# Altium schematic sheet CANBUS.SchDoc
size A4; SheetNumber: 4; SheetTotal: 5
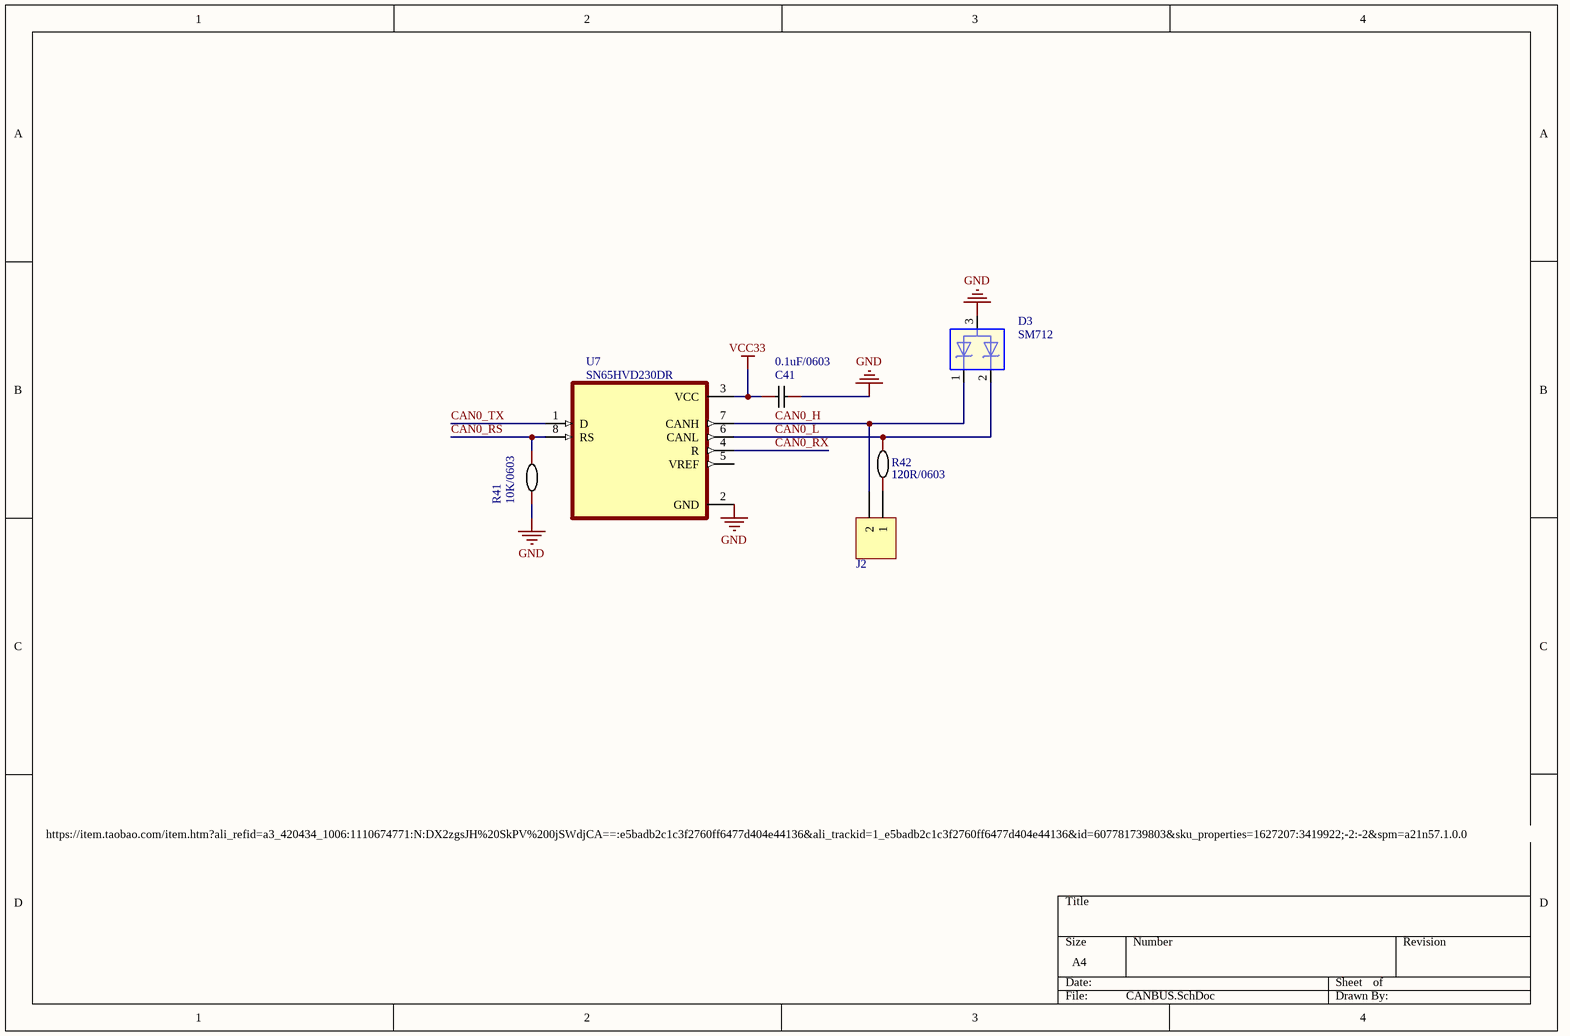
[diagram p0: CANBUS.SchDoc]

## Parts
C41  0.1uF/0603  [CAP0603]
D3  SM712  [SOT95P280X135-3N]
J2  Jumper  [HDR1X2]  (value not drawn)
R41  10K/0603  [RES0603]
R42  120R/0603  [RES0603]
U7  SN65HVD230DR  [SN65HVD230DR]

## Nets
GND: C41.1 D3.3 R41.1 U7.2(GND)
VCC33: C41.2 U7.3(VCC)
CAN0_H: D3.1 J2.2 U7.7(CANH)
CAN0_L: D3.2 R42.1 U7.6(CANL)
CAN0_RS: R41.2 U7.8(RS)
CAN0_RX: U7.4(R)
CAN0_TX: U7.1(D)
NetJ2_1: J2.1 R42.2

Not connected (* = marked no-connect by the designer): U7 5(VREF)

## Notes on the sheet
- https://item.taobao.com/item.htm?ali_refid=a3_420434_1006:1110674771:N:DX2zgsJH%20SkPV%200jSWdjCA==:e5badb2c1c3f2760ff6477d404e44136&ali_trackid=1_e5badb2c1c3f2760ff6477d404e44136&id=607781739803&sku_properties=1627207:3419922;-2:-2&spm=a21n57.1.0.0

## Library data of the parts
C41 = 100nF: Manufacturer Part: CL05B104KO5NNNC; Manufacturer: SAMSUNG; Convert to PCB: yes; Origin Footprint: C0402_NEW; Name: 100nF; Symbol: 100nF; Device: 100nF; Supplier: LCSC; Supplier Part: C1525; JLCPCB Part Class: Basic Part; Add into BOM: yes
D3 = SM05_D24: 兩路TVS二极管阵列; Part Number: 702112964; Origin: Altium; Design: 3; PCB Footprint: SOT95P280X135-3N
J2 = Header 2: Header, 2-Pin; LatestRevisionDate: 17-Jul-2002; LatestRevisionNote: Re-released for DXP Platform.; Publisher: Altium Limited
R41 = 10K: Manufacturer: UniOhm; Manufacturer Part: 0402WGF1002TCE; Convert to PCB: yes; Origin Footprint: R0402; Name: 10K; Symbol: 10K; Device: 10K; Supplier: LCSC; Supplier Part: C25744; JLCPCB Part Class: Basic Part; Add into BOM: yes
R42 = 120: Manufacturer: RALEC; Manufacturer Part: RTT061200FTP; Convert to PCB: yes; Origin Footprint: R1206; Name: 120; Symbol: 120; Device: 120; Supplier: LCSC; Supplier Part: C159715; JLCPCB Part Class: Extended Part; Add into BOM: yes
U7 = SN65HVD230DR: 3.3 V CAN Transceiver with Standby Mode; MF: Texas Instruments; Availability: In Stock; SnapEDA_Link: https://www.snapeda.com/parts/SN65HVD230DR/Texas+Instruments/view-part/?ref=snap; Price: None; Check_prices: https://www.snapeda.com/parts/SN65HVD230DR/Texas+Instruments/view-part/?ref=eda; Package: SOIC-8 Texas Instruments; MP: SN65HVD230DR; Value: *; Purchase-URL: https://pricing.snapeda.com/search/part/SN65HVD230DR/?ref=eda